# Altium schematic sheet Sheet2.SchDoc
size A; SheetNumber: 1; SheetTotal: 1
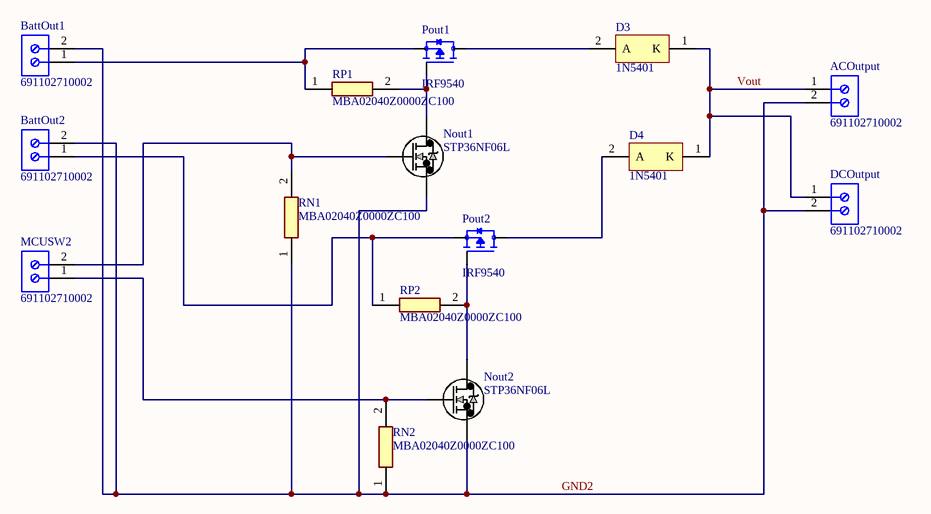
[diagram p0: Sheet2.SchDoc]

## Parts
ACOutput  691102710002  [691102710002]
BattOut1  691102710002  [691102710002]
BattOut2  691102710002  [691102710002]
D3  1N5401  [ONSC-AXIAL_LEAD-2-267-05_V]
D4  1N5401  [ONSC-AXIAL_LEAD-2-267-05_V]
DCOutput  691102710002  [691102710002]
MCUSW2  691102710002  [691102710002]
Nout1  STP36NF06L  [TO-220_STM]
Nout2  STP36NF06L  [TO-220_STM]
Pout1  IRF9540  [TO254P1052X465X1989-3]
Pout2  IRF9540  [TO254P1052X465X1989-3]
RN1  MBA02040Z0000ZC100  [RESAD1000W50L360D160]
RN2  MBA02040Z0000ZC100  [RESAD1000W50L360D160]
RP1  MBA02040Z0000ZC100  [RESAD1000W50L360D160]
RP2  MBA02040Z0000ZC100  [RESAD1000W50L360D160]

## Nets
GND2: ACOutput.2 BattOut1.2 BattOut2.2 DCOutput.2 Nout1.3 Nout2.3 RN1.1 RN2.1
Vout: ACOutput.1 D3.1(K) D4.1(K) DCOutput.1
NetBattOut1_1: BattOut1.1 Pout1.3(S) RP1.1
NetBattOut2_1: BattOut2.1 Pout2.3(S) RP2.1
NetD3_2: D3.2(A) Pout1.2(D)
NetD4_2: D4.2(A) Pout2.2(D)
NetMCUSW2_1: MCUSW2.1 Nout2.1 RN2.2
NetMCUSW2_2: MCUSW2.2 Nout1.1 RN1.2
NetNout1_2: Nout1.2 Pout1.1(G) RP1.2
NetNout2_2: Nout2.2 Pout2.1(G) RP2.2

## Library data of the parts
ACOutput BattOut1 BattOut2 DCOutput MCUSW2 = CMP-1502-03258-1: Series 102 - 5.00 mm Horizontal Entry Modular with Pressure Clamp WR-TBL, 2 pin; Manufacturer: Wurth Elektronik; Pin Number: 2; Pitch: 5.00mm; Manufacturer URL: http://www.we-online.de; Mounting Technology: THT; Publisher: WurthElektronik; Packaging: Box; Package Reference: 691102710002; Datasheet URL: http://katalog.we-online.de/em/datasheet/6911027100xx.pdf; Operating Temperature: -40to105degC; Part Number: 691102710002
D3 D4 = CMP-0902-00078-1: Standard Recovery Rectifier, 2-Pin Axial_Lead, Pb-Free, Bulk Box; Manufacturer: On Semiconductor; IO(rec) Max (A): 3; VRRM Max (V): 100; IFSM Max (A): 200; PartNumber: 1N5401; RoHS: TRUE; ComponentLink1URL: http://www.onsemi.com/; Mounting Technology: Through Hole; PackageDescription: 2-Pin, Axial Lead, Diameter 5.05 mm; ComponentLink1Description: Manufacturer URL; ComponentLink3Description: Package Specification; ComponentLink2URL: http://www.onsemi.com/pub_link/Collateral/1N5400-D.PDF; Type: Standard Recovery; PackageReference: AXIAL_LEAD-2-267-05; ComponentLink3URL: http://www.onsemi.com/pub_link/Collateral/267-05.PDF; Packing: Bulk Box; DatasheetVersion: Rev. 10; PackageVersion: Rev. G, 06/2000; ComponentLink2Description: Datasheet
Nout1 Nout2 = STP36NF06L: No Description Available; Mfr_Name: STMicroelectronics; Copyright: Copyright (C) 2022 Ultra Librarian. All rights reserved.; Manufacturer_Part_Number: STP36NF06L; Digi-Key_Part_Number_1: 497-7522-5-ND; RefDes: RefDes; Type: DEV
Pout1 Pout2 = IRF9540: P-Channel 100V 19A (Tc) 150W (Tc) Through Hole TO-220AB; MF: Vishay Siliconix; MP: IRF9540; Package: TO-220 International Rectifier; Value: *; Digi-Key_Part_Number: IRF9540PBF-ND; SnapEDA_Link: https://www.snapeda.com/parts/IRF9540/Vishay%20Siliconix/view-part/1087953/?ref=snap
RN1 RN2 RP1 RP2 = MBA02040Z0000ZC100: Resistor; Manufacturer_Name: Vishay; Datasheet Link: https://www.vishay.com/docs/28766/mbxsma.pdf; Manufacturer_Part_Number: MBA02040Z0000ZC100